# Altium project TAUV_Acoustics_V2.PrjPcb
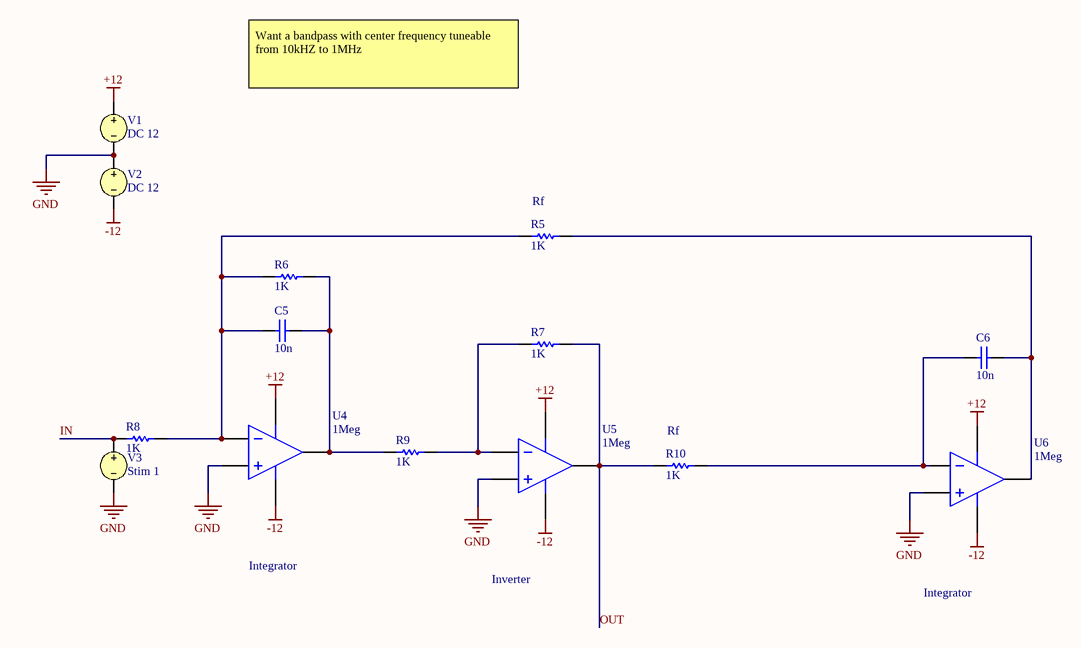
[diagram p0: Biquad_Sim.SchDoc]
3 sheets, 29 parts. Net scope: global (net labels, ports and power ports of the same name join across sheets).
Sheets:
  Main.SchDoc
  Biquad_Sim.SchDoc
  Biquad.SchDoc

## Sheet Main.SchDoc
size A; SheetNumber: 1; SheetTotal: 1

## Sheet Biquad_Sim.SchDoc
size A; SheetNumber: 3; SheetTotal: 3

### Parts
C5  value 10n  (hidden comment: Capacitor)
C6  value 10n  (hidden comment: Capacitor)
R5  value 1K  (hidden comment: Resistor)
R6  value 1K  (hidden comment: Resistor)
R7  value 1K  (hidden comment: Resistor)
R8  value 1K  (hidden comment: Resistor)
R9  value 1K  (hidden comment: Resistor)
R10  value 1K  (hidden comment: Resistor)
U4  GAIN: 1Meg  (hidden comment: Ideal Operational Amplifier)
U5  GAIN: 1Meg  (hidden comment: Ideal Operational Amplifier)
U6  GAIN: 1Meg  (hidden comment: Ideal Operational Amplifier)
V1  DC 12
V2  DC 12
V3  Stim 1

### Nets
+12: U4.4(V+) U5.4(V+) U6.4(V+) V1.1
-12: U4.5(V-) U5.5(V-) U6.5(V-) V2.2
GND: U4.2(IN+) U5.2(IN+) U6.2(IN+) V1.2 V2.1 V3.2
IN: R8.1 V3.1
OUT: R7.2 R10.1 U5.3(OUT)
NetC5_1: C5.1 R5.1 R6.1 R8.2 U4.1(IN-)
NetC5_2: C5.2 R6.2 R9.1 U4.3(OUT)
NetC6_1: C6.1 R10.2 U6.1(IN-)
NetC6_2: C6.2 R5.2 U6.3(OUT)
NetR7_1: R7.1 R9.2 U5.1(IN-)

### Notes on the sheet
- Want a bandpass with center frequency tuneable from 10kHZ to 1MHz
- (near R5) Rf
- (near R10) Rf
- Integrator
- Inverter

### Library data of the parts
C5 C6 = Capacitor: SimulationGenericComponent: True
R5-R10 = Resistor: TC1: 0; SimulationGenericComponent: True; TC2: 0
U4-U6 = OpAmp with power terminals: SimulationGenericComponent: True
V1 V2 = VSRC: Voltage Source; Note: PCB Footprint - Not required; AC Magnitude: 1; AC Phase: 0; Value: 12; Published: 8-Jun-2000; LatestRevisionDate: 17-Jul-2002; LatestRevisionNote: Re-released for DXP Platform.; PackageReference: Not Applicable; Publisher: Altium Limited
V3 = VSRC: Voltage Source; Note: PCB Footprint - Not required; AC Magnitude: 1; AC Phase: 0; Frequency: 1K; Published: 8-Jun-2000; LatestRevisionDate: 17-Jul-2002; LatestRevisionNote: Re-released for DXP Platform.; PackageReference: Not Applicable; Publisher: Altium Limited; DC Magnitude: 0; Offset: 0; Amplitude: 1; Delay: 0; Damping Factor: 0; Phase: 0

## Sheet Biquad.SchDoc
size A; SheetNumber: 6; SheetTotal: 6
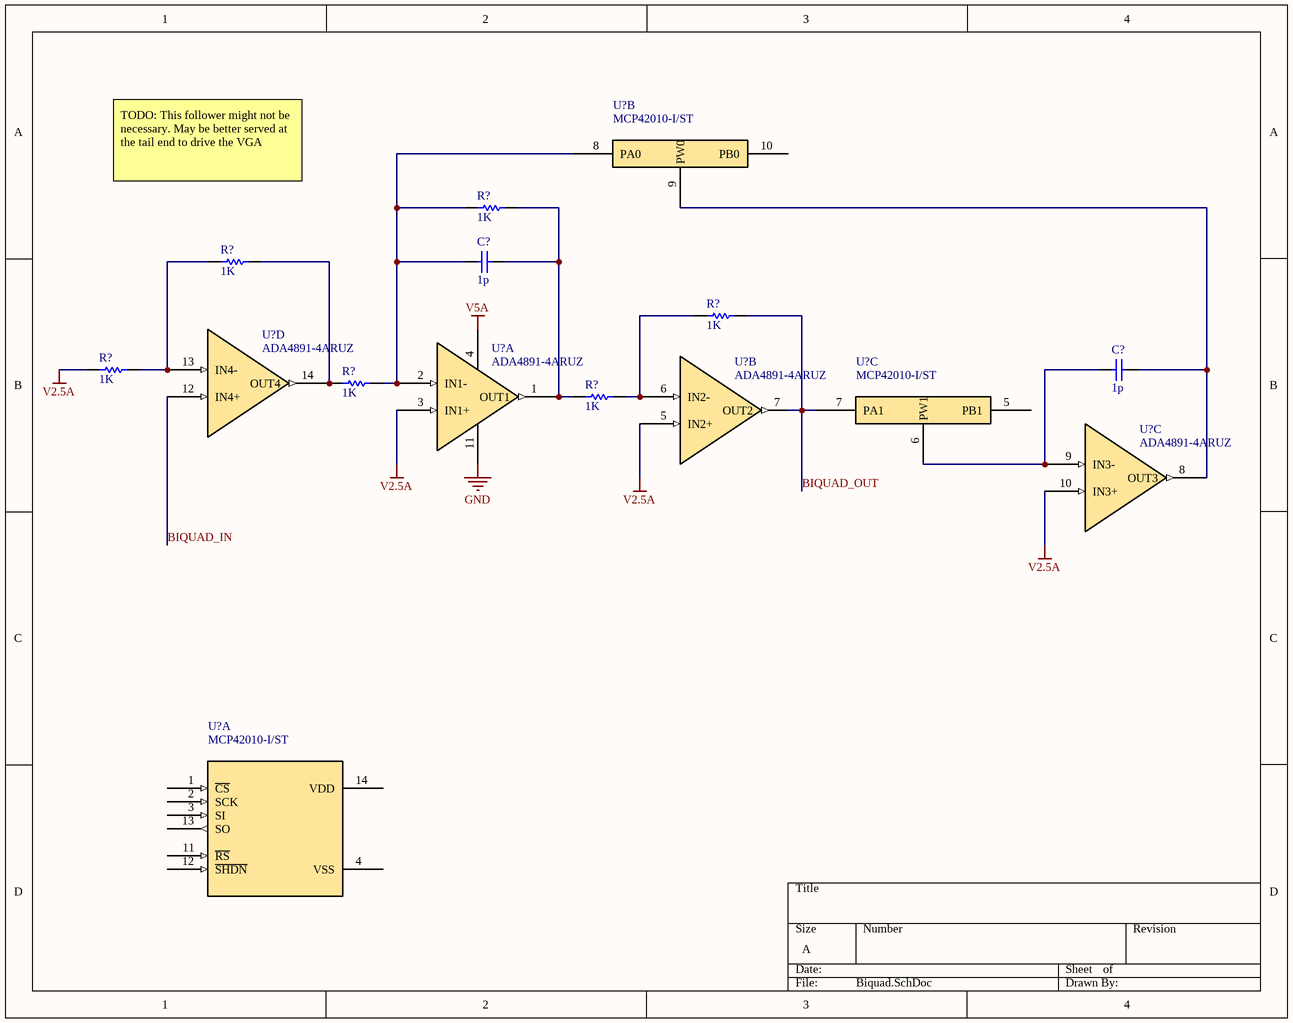
[diagram p1: Biquad.SchDoc]

### Parts
(Parts that share a designator on the sheet are numbered #1, #2 ... from top to bottom, then left to right.)
C?#1  value 1p  (hidden comment: Capacitor)
C?#2  value 1p  (hidden comment: Capacitor)
R?#1  value 1K  (hidden comment: Resistor)
R?#2  value 1K  (hidden comment: Resistor)
R?#3  value 1K  (hidden comment: Resistor)
R?#4  value 1K  (hidden comment: Resistor)
R?#5  value 1K  (hidden comment: Resistor)
R?#6  value 1K  (hidden comment: Resistor)
U?#1  MCP42010-I/ST  (part B of 3)
U?#2  ADA4891-4ARUZ  (part D of 4)
U?#3  ADA4891-4ARUZ  (part A of 4)
U?#4  ADA4891-4ARUZ  (part B of 4)
U?#5  MCP42010-I/ST  (part C of 3)
U?#6  ADA4891-4ARUZ  (part C of 4)
U?#7  MCP42010-I/ST  (part A of 3)

### Nets
GND: U?#3.11(V-)
V2.5A: R?#4.1 U?#3.3(IN1+) U?#4.5(IN2+) U?#6.10(IN3+)
V5A: U?#3.4(V+)
BIQUAD_IN: U?#2.12(IN4+)
BIQUAD_OUT: R?#3.2 U?#4.7(OUT2) U?#5.7(PA1)
NetC?#1_1: C?#1.1 R?#1.1 R?#5.2 U?#1.8(PA0) U?#3.2(IN1-)
NetC?#1_2: C?#1.2 R?#1.2 R?#6.1 U?#3.1(OUT1)
NetC?#2_1: C?#2.1 U?#5.6(PW1) U?#6.9(IN3-)
NetC?#2_2: C?#2.2 U?#1.9(PW0) U?#6.8(OUT3)
NetR?#2_1: R?#2.1 R?#4.2 U?#2.13(IN4-)
NetR?#2_2: R?#2.2 R?#5.1 U?#2.14(OUT4)
NetR?#3_1: R?#3.1 R?#6.2 U?#4.6(IN2-)

Not connected (* = marked no-connect by the designer): U?#1 10(PB0); U?#5 5(PB1); U?#7 1(~{CS}) 2(SCK) 3(SI) 4(VSS) 11(~{RS}) 12(~{SHDN}) 13(SO) 14(VDD)

### Notes on the sheet
- TODO: This follower might not be necessary. May be better served at the tail end to drive the VGA

### Library data of the parts
C?#1 C?#2 = Capacitor: SimulationGenericComponent: True
R?#1-R?#6 = Resistor: TC1: 0; SimulationGenericComponent: True; TC2: 0
U?#1 U?#5 U?#7 = MCP42010-I/ST: Digital Potentiometer 10k Ohm 2 Circuit 256 Taps SPI Interface 14-TSSOP
U?#2-U?#4 U?#6 = ADA4891-4ARUZ: CMOS Amplifier 4 Circuit Rail-to-Rail 14-TSSOP

## Nets that join several sheets
GND: Biquad_Sim (6 pins), Biquad (U?#3.11)